# EasyEDA schematic timer_switch.json
TITLE: Sheet_1; REV: 1.0; Date: 2021-03-21; Sheet: 1/1; Drawn By: QueenOfTheNorth; Company: Your Company
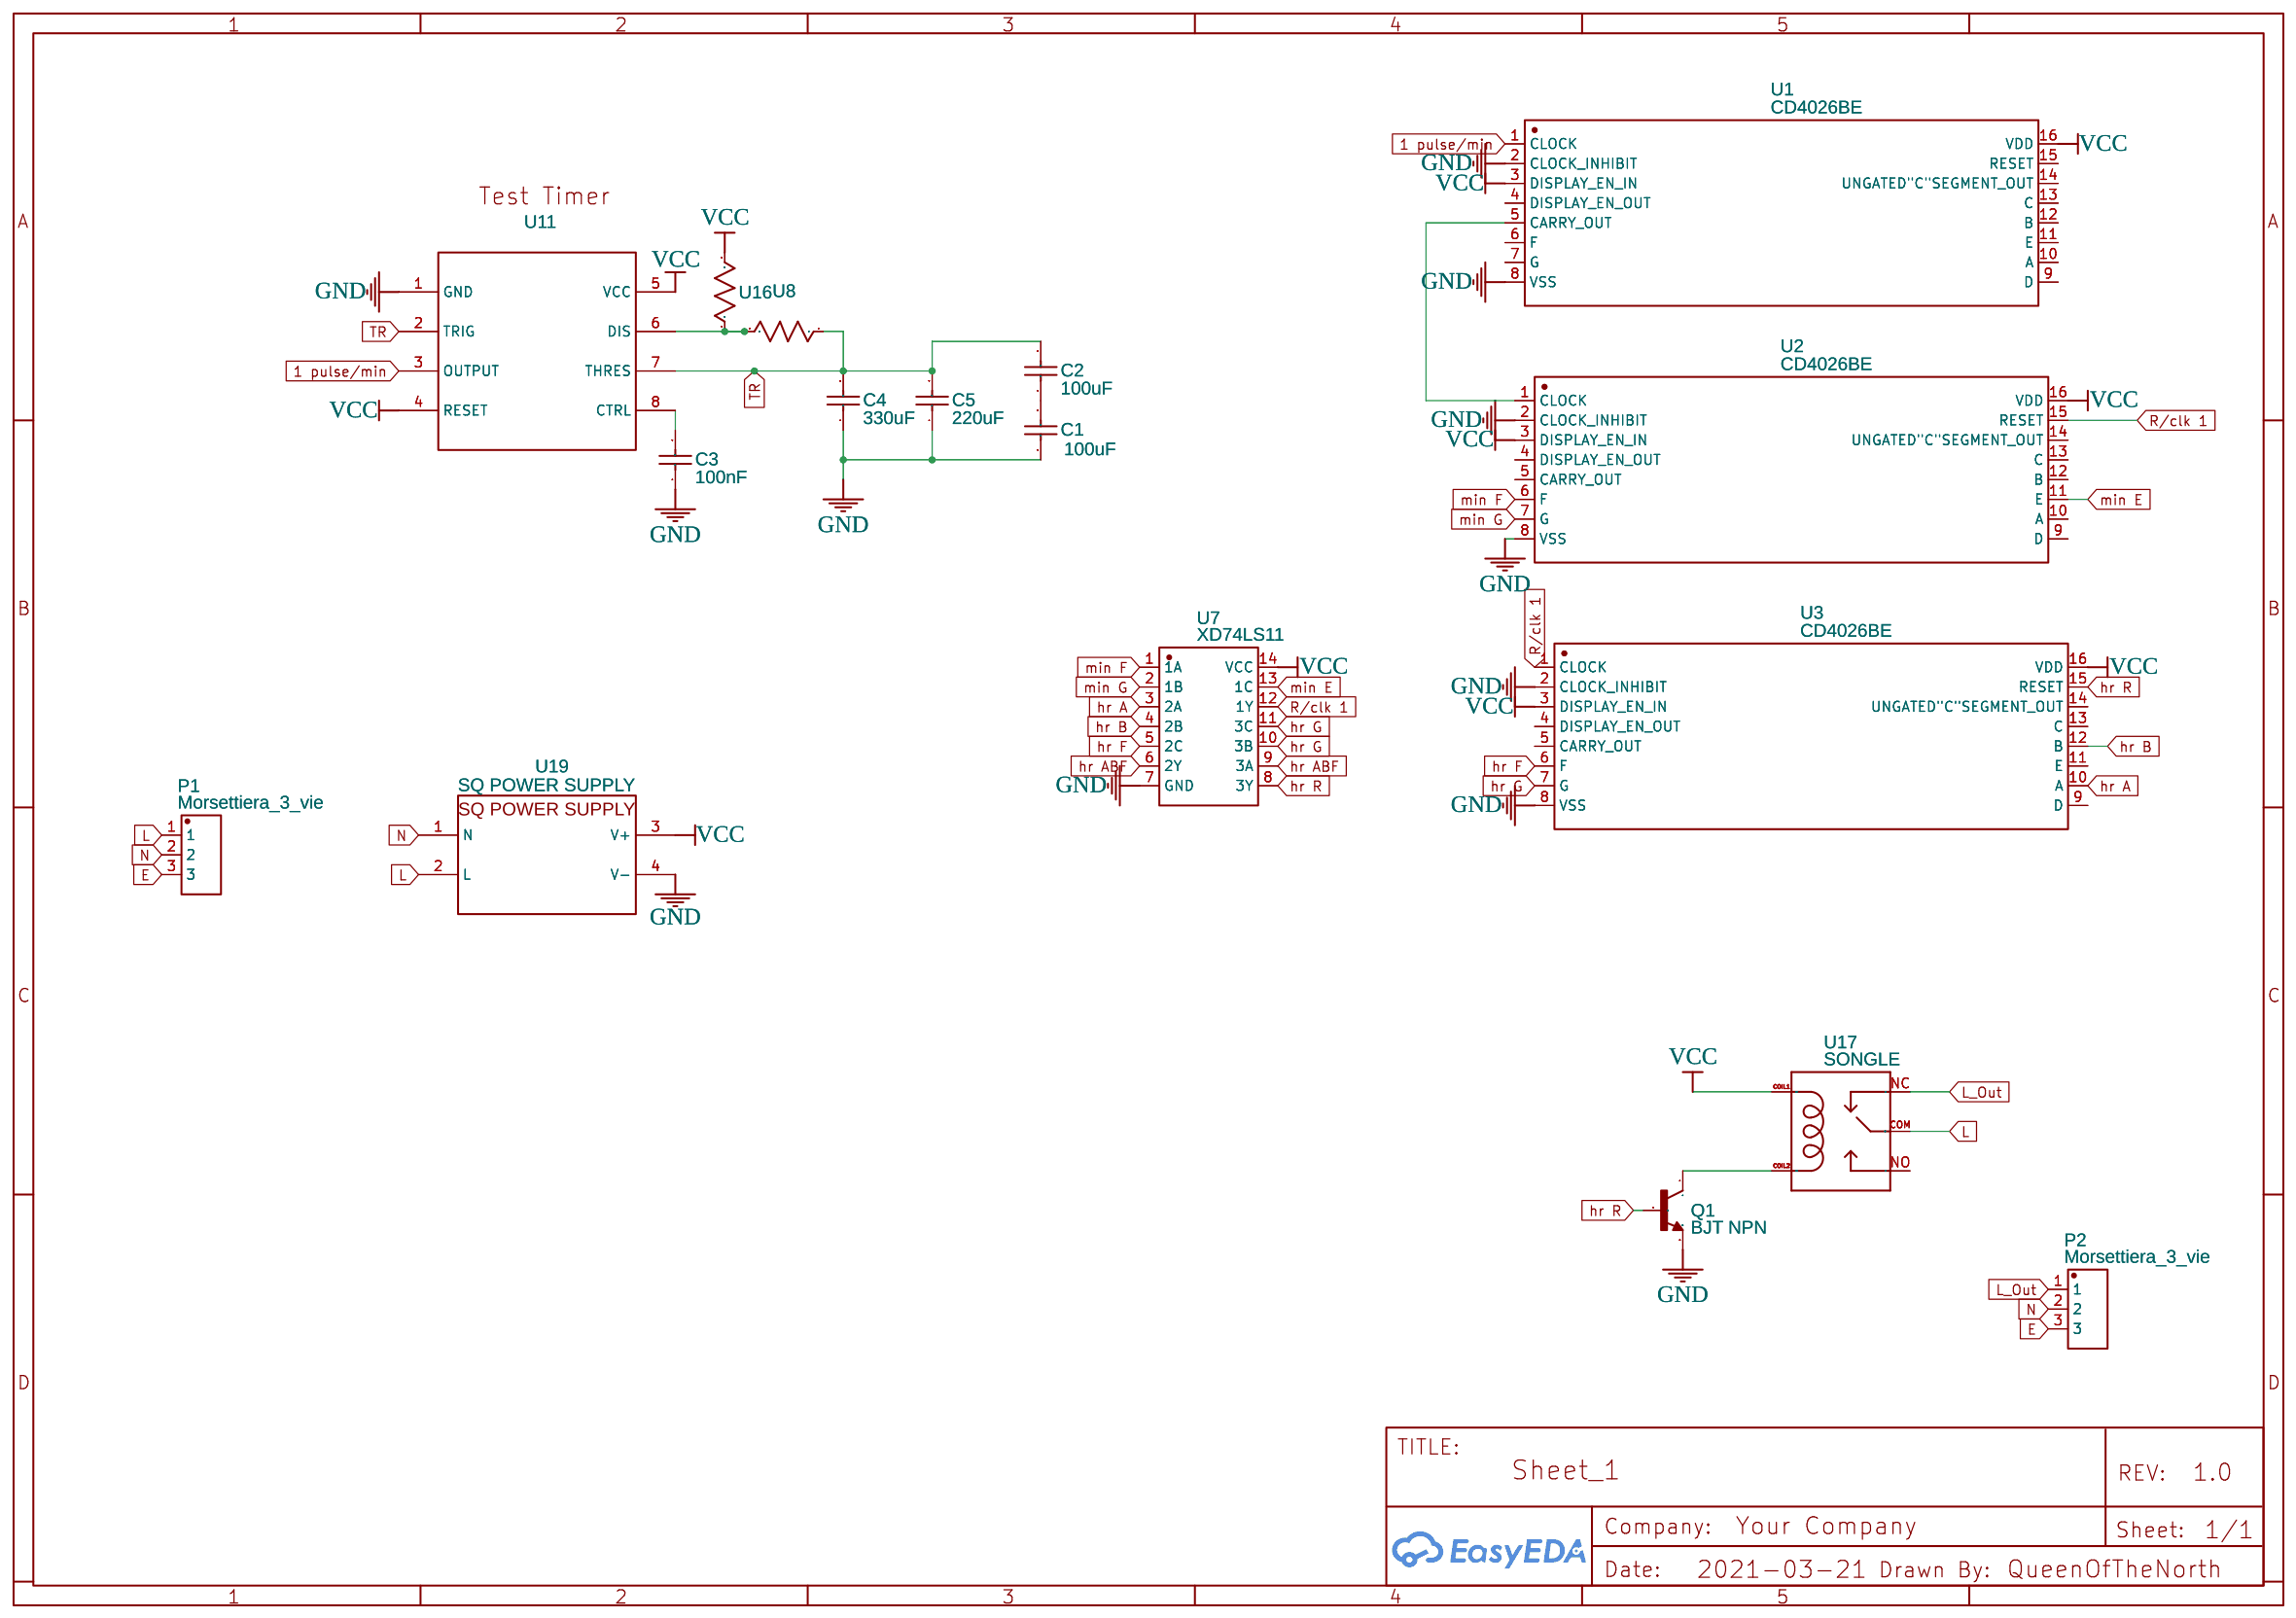
[diagram p0: schematic sheet]

## Parts
C1  100uF  [CAP-TH_L7.2-W3.5-P5.00-D0.5]
C2  100uF  [CAP-TH_L7.2-W3.5-P5.00-D0.5]
C3  100nF  [CAP-TH_L7.2-W3.5-P5.00-D0.5]
C4  330uF  [CAP-TH_L7.2-W3.5-P5.00-D0.5]
C5  220uF  [CAP-TH_L7.2-W3.5-P5.00-D0.5]
P1  Morsettiera_3_vie  [WJ2EDGV-5.08-3P]
P2  Morsettiera_3_vie  [WJ2EDGV-5.08-3P]
Q1  BJT NPN  [TO-92]
U1  CD4026BE  [DIP-16_L20.3-W10.2-P2.54-LS10.2-BL]
U2  CD4026BE  [DIP-16_L20.3-W10.2-P2.54-LS10.2-BL]
U3  CD4026BE  [DIP-16_L20.3-W10.2-P2.54-LS10.2-BL]
U7  XD74LS11  [DIP-14_L19.4-W6.4-P2.54-LS7.6-BL]
U8  RESISTOR  [0.4W 1% RESISTOR]
U11  Test Timer SCH  [IC  555]
U16  RESISTOR  [0.4W 1% RESISTOR]
U17  SONGLE  [SONGLE]
U19  SQ POWER SUPPLY  [SQ POWER SUPPLY]

## Library data of the parts
C1-C5 = Calibration capacitor100nF（104）100V,5%: Supplier: LCSC; Manufacturer: ReliaPro; Supplier Part: C26609
P1 P2 = Morsettiera_3_vie: Supplier Part: C23595; Supplier: LCSC; Manufacturer: ReliaPro; Manufacturer Part: Terminals/WJ2EDGV-5.08-8P; image: //image.lceda.cn/szlcsc/C23595.jpg; Contributor: ilmanciobo
Q1 = BJT NPN: Mounted: Yes
U1-U3 = CD4026BE: Supplier: LCSC; Manufacturer: TI; Supplier Part: C89909; LCSC Assembly: Yes; SMT Type: Extend; Paste Type: expand
U7 = XD74LS11: Supplier: LCSC; Supplier Part: C521167; Manufacturer: XINLUDA(信路达); Contributor: LCSC
U8 U16 = RESISTOR: Contributor: dannyjacket
U11 = Test Timer SCH: Manufacturer Part: 555 Timer; Contributor: ST Team
U17 = SONGLE: Contributor: xlbtlmy
U19 = SQ POWER SUPPLY: Contributor: BrianOlasya

## Nets
GND: C1.1 C3.1 C4.1 C5.1 Q1.3 U1.2(CLOCK_INHIBIT) U1.8(VSS) U2.2(CLOCK_INHIBIT) U2.8(VSS) U3.2(CLOCK_INHIBIT) U3.8(VSS) U7.7(GND) U11.1(GND) U19.4(V-)
VCC: U1.3(DISPLAY_EN_IN) U1.16(VDD) U2.3(DISPLAY_EN_IN) U2.16(VDD) U3.3(DISPLAY_EN_IN) U3.16(VDD) U7.14(VCC) U11.4(RESET) U11.5(VCC) U16.2 U17.COIL1 U19.3(V+)
1 pulse/min: U1.1(CLOCK) U11.3(OUTPUT)
E: P1.3 P2.3
hr A: U3.10(A) U7.3(2A)
hr ABF: U7.6(2Y) U7.9(3A)
hr B: U3.12(B) U7.4(2B)
hr F: U3.6(F) U7.5(2C)
hr G: U3.7(G) U7.10(3B) U7.11(3C)
hr R: Q1.2 U3.15(RESET) U7.8(3Y)
L: P1.1 U17.COM U19.2(L)
L_Out: P2.1 U17.NC
min E: U2.11(E) U7.13(1C)
min F: U2.6(F) U7.1(1A)
min G: U2.7(G) U7.2(1B)
N: P1.2 P2.2 U19.1(N)
R/clk 1: U2.15(RESET) U3.1(CLOCK) U7.12(1Y)
TR: C2.2 C4.2 C5.2 U8.1 U11.2(TRIG) U11.7(THRES)
Net-(C1-2): C1.2 C2.1
Net-(C3-2): C3.2 U11.8(CTRL)
Net-(Q1-1): Q1.1 U17.COIL2
Net-(U1-5): U1.5(CARRY_OUT) U2.1(CLOCK)
Net-(U8-2): U8.2 U11.6(DIS) U16.1

Not connected (* = marked no-connect by the designer): U1 4(DISPLAY_EN_OUT) 6(F) 7(G) 9(D) 10(A) 11(E) 12(B) 13(C) 14(UNGATED"C"SEGMENT_OUT) 15(RESET); U2 4(DISPLAY_EN_OUT) 5(CARRY_OUT) 9(D) 10(A) 12(B) 13(C) 14(UNGATED"C"SEGMENT_OUT); U3 4(DISPLAY_EN_OUT) 5(CARRY_OUT) 9(D) 11(E) 13(C) 14(UNGATED"C"SEGMENT_OUT); U17 NO
